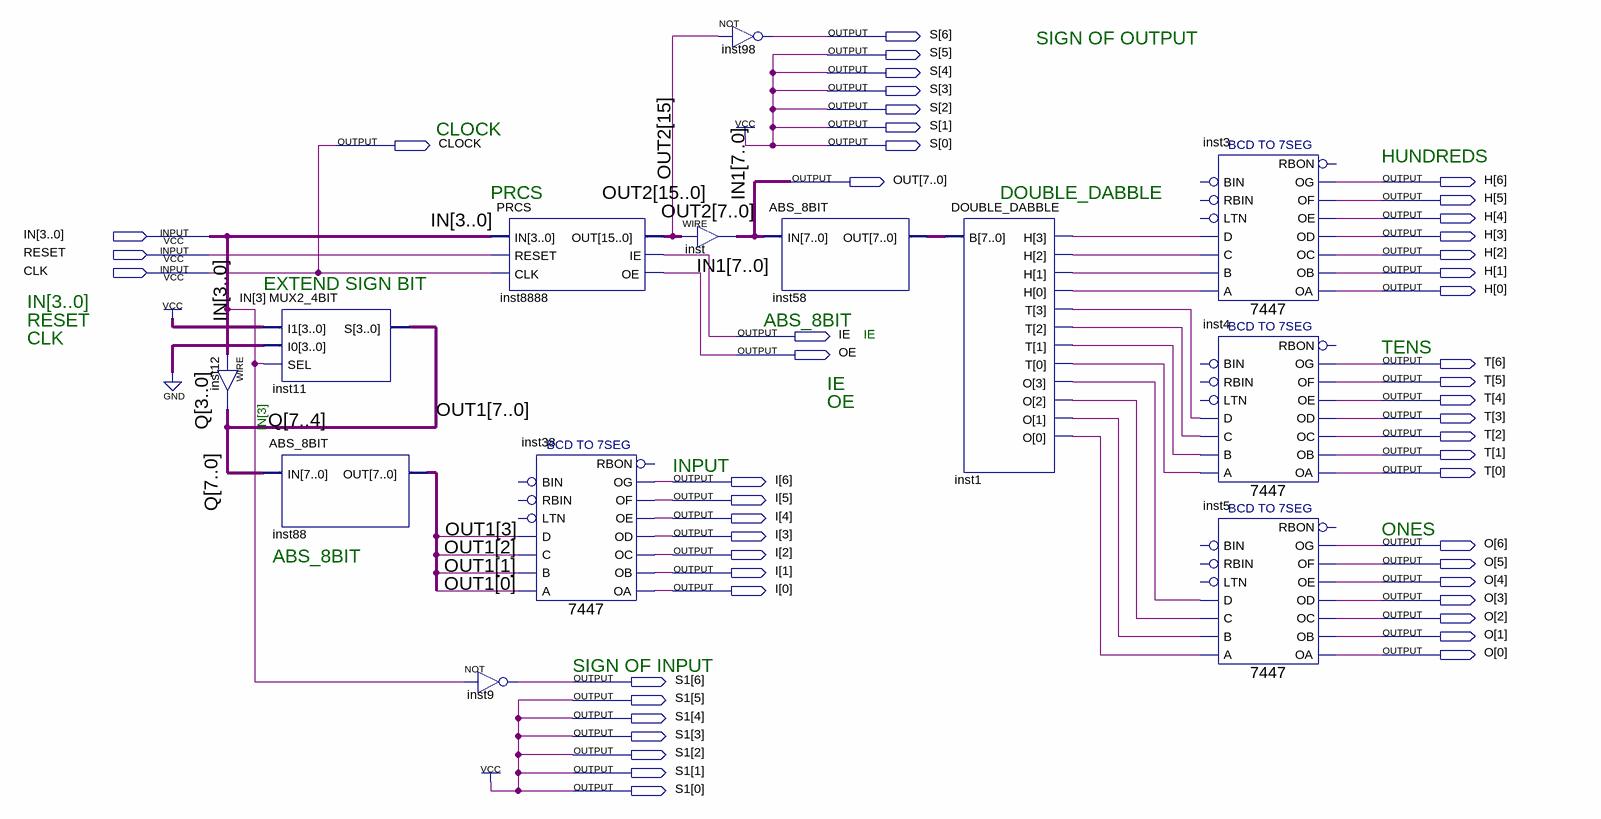
[diagram p0: schematic sheet]
// Quartus schematic PRSC_DE2KIT.bdf as structural Verilog: 13 symbols, 49 pins
module PRSC_DE2KIT (
  input  [3:0] IN,
  input  RESET,
  input  CLK,
  output [6:0] S,
  output CLOCK,
  output [7:0] OUT,
  output [6:0] H,
  output IE,
  output OE,
  output [6:0] T,
  output [6:0] I,
  output [6:0] O,
  output [6:0] S1
);

  wire inst1_h, inst1_h_2, inst1_h_3, inst1_h_4, inst1_o, inst1_o_2, inst1_o_3, inst1_o_4, inst1_t,
       inst1_t_2, inst1_t_3, inst1_t_4;
  wire [7:0] inst58_out, OUT1, Q;
  wire [15:0] OUT2;

  MUX2_4BIT inst11 (.I1(4'b1111), .I0(4'b0000), .SEL(IN[3]), .S(Q[7:4]));
  assign Q[3:0] = IN;  // WIRE inst12
  ABS_8BIT inst88 (.IN(Q), .OUT(OUT1));
  not inst9 (S1[6], IN[3]);
  PRCS inst8888 (.IN(IN), .RESET(RESET), .CLK(CLK), .OUT(OUT2), .IE(IE), .OE(OE));
  \7447  inst38 (
    .B(OUT1[1]), .C(OUT1[2]), .D(OUT1[3]), .A(OUT1[0]), .OB(I[1]), .OC(I[2]), .OE(I[4]), .OD(I[3]),
    .OF(I[5]), .OG(I[6]), .OA(I[0]));  // open: LTN, RBIN, BIN, RBON
  assign OUT = OUT2[7:0];  // WIRE inst
  not inst98 (S[6], OUT2[15]);
  ABS_8BIT inst58 (.IN(OUT), .OUT(inst58_out));
  DOUBLE_DABBLE inst1 (
    .B(inst58_out), .H({inst1_h, inst1_h_2, inst1_h_3, inst1_h_4}),
    .T({inst1_t, inst1_t_2, inst1_t_3, inst1_t_4}), .O({inst1_o, inst1_o_2, inst1_o_3, inst1_o_4}));
  \7447  inst3 (
    .B(inst1_h_3), .C(inst1_h_2), .D(inst1_h), .A(inst1_h_4), .OB(H[1]), .OC(H[2]), .OE(H[4]), .OD(H[3]),
    .OF(H[5]), .OG(H[6]), .OA(H[0]));  // open: LTN, RBIN, BIN, RBON
  \7447  inst4 (
    .B(inst1_t_3), .C(inst1_t_2), .D(inst1_t), .A(inst1_t_4), .OB(T[1]), .OC(T[2]), .OE(T[4]), .OD(T[3]),
    .OF(T[5]), .OG(T[6]), .OA(T[0]));  // open: LTN, RBIN, BIN, RBON
  \7447  inst5 (
    .B(inst1_o_3), .C(inst1_o_2), .D(inst1_o), .A(inst1_o_4), .OB(O[1]), .OC(O[2]), .OE(O[4]), .OD(O[3]),
    .OF(O[5]), .OG(O[6]), .OA(O[0]));  // open: LTN, RBIN, BIN, RBON

  assign CLOCK = CLK;
  assign S[5:0] = {6{1'b1}};
  assign S1[5:0] = {6{1'b1}};

  // Other names for the same wires on the sheet: IN1[7:0] = OUT

  // Notes on the sheet:
  //   SIGN OF OUTPUT
  //   CLOCK
  //   HUNDREDS
  //   PRCS
  //   DOUBLE_DABBLE
  //   EXTEND SIGN BIT
  //   IN[3..0]
  //   RESET
  //   ABS_8BIT
  //   CLK
  //   IE
  //   TENS
  //   IE
  //   OE
  //   IN[3]
  //   INPUT
  //   ONES
  //   ABS_8BIT
  //   SIGN OF INPUT
endmodule
